# Altium project 6502.PrjPcb
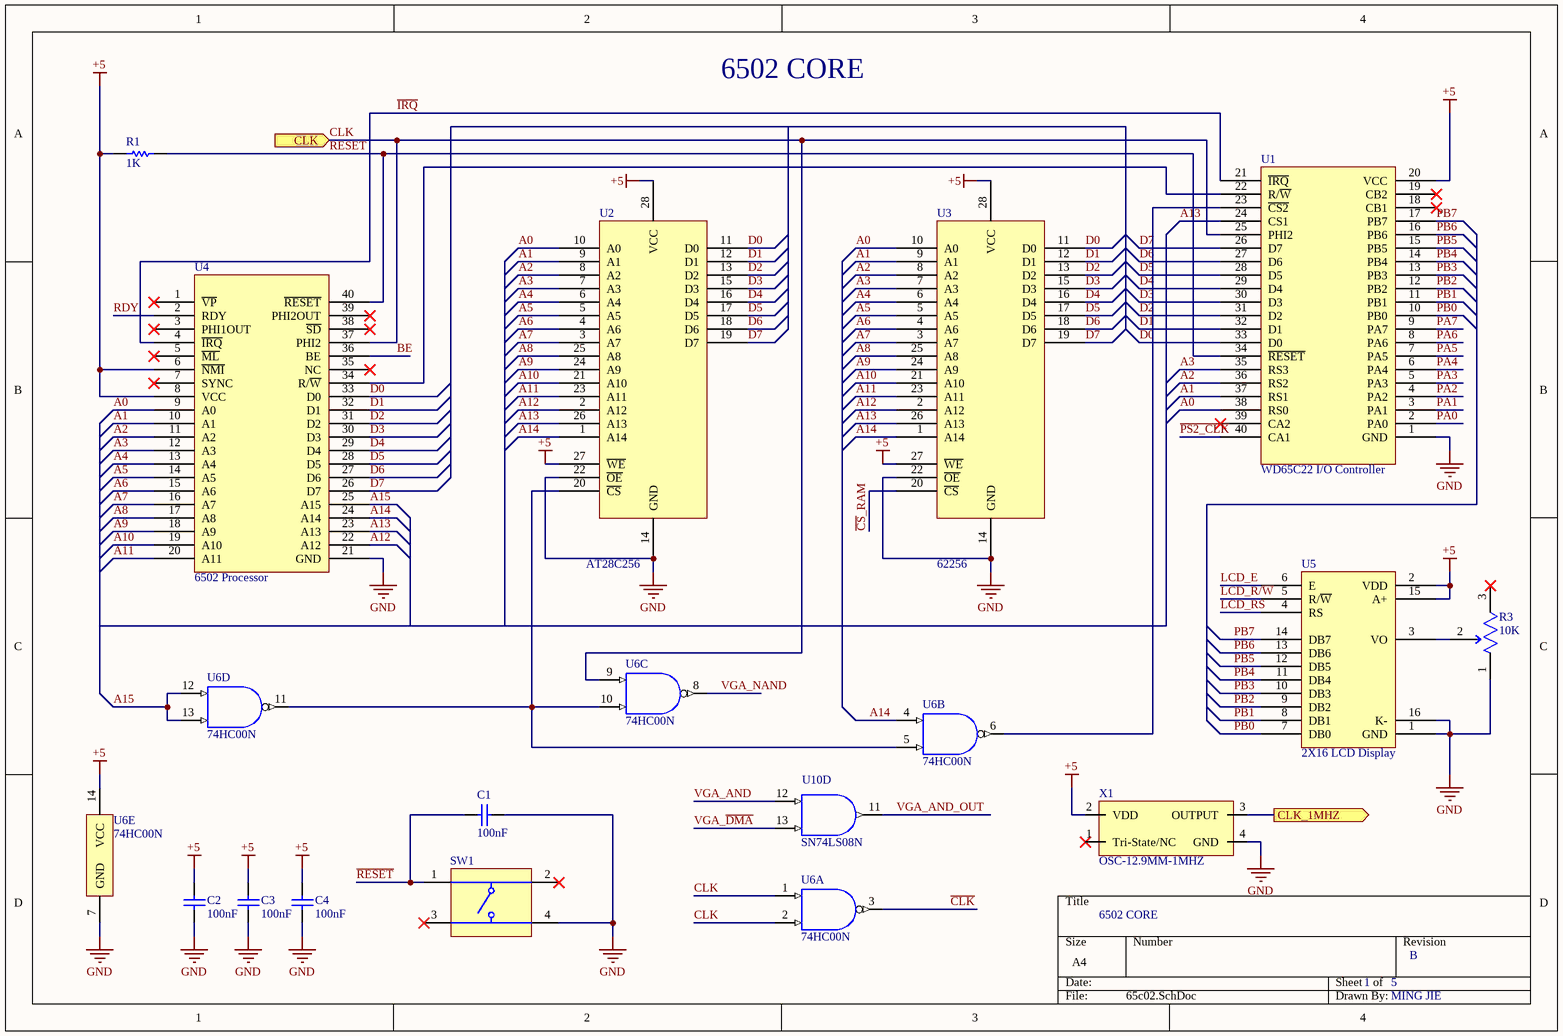
[diagram p0: 65c02.SchDoc]
5 sheets, 111 parts. Net scope: global (net labels, ports and power ports of the same name join across sheets).
Board file: 6502_carrier.PcbDoc
Sheets:
  65c02.SchDoc
  clock_module.SchDoc
  address_LEDs.SchDoc
  config_headers.SchDoc
  ps2_interface.SchDoc

## Sheet 65c02.SchDoc: 6502 Core
size A4; Engineer: Ming Jie See; Revision: 1; SheetNumber: 1; SheetTotal: 5

### Parts
C1  Capacitance: 100nF  [CAPC2013X135X45ML10T25]  (hidden comment: GRM21BR71H104KA01L)
C2  Capacitance: 100nF  [CAPC2013X135X45ML10T25]  (hidden comment: GRM21BR71H104KA01L)
C3  Capacitance: 100nF  [CAPC2013X135X45ML10T25]  (hidden comment: GRM21BR71H104KA01L)
C4  Capacitance: 100nF  [CAPC2013X135X45ML10T25]  (hidden comment: GRM21BR71H104KA01L)
R1  Resistance: 1K  [RESC2013X50X30NL20T20]  (hidden comment: CRCW08051K00FKEA)
R3  Resistance: 10K  [FP-3296W-MFG]  (hidden comment: 3296W-1-103RLF)
SW1  K2-1102SP-C4SC-04  [TECO-FSM4JSMA_V]  (value not drawn)
U1  WD65C22 I/O Controller  [PDIP_40]
U2  AT28C256  [DIP_28]
U3  62256  [DIP_28]
U4  6502 Processor  [PDIP_40]
U5  2X16 LCD Display  [LCD_2x16]
U6  74HC00N  [NXP-SOT27-1-14]  (parts A,B,C,D,E of 5)
U10  SN74LS08N  [N0014A]  (part D of 5)
X1  OSC-12.9MM-1MHZ  [OSC_THT_12-9MM]

### Ports
CLK (in), CLK_1MHZ (out)

### Nets
+5: C2.1 C3.1 C4.1 R1.1 U1.20(VCC) U2.27(~{WE}) U2.28(VCC) U3.27(~{WE}) U3.28(VCC) U4.6(~{NMI}) U4.8(VCC) U5.2(VDD) U5.15(A+) U6.14(VCC) X1.2(VDD)
GND: C1.1 C2.2 C3.2 C4.2 R3.1(CCW) SW1.4 U1.1(GND) U2.14(GND) U2.22(~{OE}) U3.14(GND) U3.22(~{OE}) U4.21(GND) U5.1(GND) U5.16(K-) U6.7(GND) X1.4(GND)
A0: U1.38(RS0) U2.10(A0) U3.10(A0) U4.9(A0)
A1: U1.37(RS1) U2.9(A1) U3.9(A1) U4.10(A1)
A2: U1.36(RS2) U2.8(A2) U3.8(A2) U4.11(A2)
A3: U1.35(RS3) U2.7(A3) U3.7(A3) U4.12(A3)
A4: U2.6(A4) U3.6(A4) U4.13(A4)
A5: U2.5(A5) U3.5(A5) U4.14(A5)
A6: U2.4(A6) U3.4(A6) U4.15(A6)
A7: U2.3(A7) U3.3(A7) U4.16(A7)
A8: U2.25(A8) U3.25(A8) U4.17(A8)
A9: U2.24(A9) U3.24(A9) U4.18(A9)
A10: U2.21(A10) U3.21(A10) U4.19(A10)
A11: U2.23(A11) U3.23(A11) U4.20(A11)
A12: U2.2(A12) U3.2(A12) U4.22(A12)
A13: U1.24(CS1) U2.26(A13) U3.26(A13) U4.23(A13)
A14: U2.1(A14) U3.1(A14) U4.24(A14) U6.4(2A)
A15: U4.25(A15) U6.12(4A) U6.13(4B)
BE: U4.36(BE)
~{CLK}: U6.3(~{1Y})
~{CS}_RAM: U3.20(~{CS})
CLK: U1.25(PHI2) U4.37(PHI2) U6.1(1A) U6.2(1B) U6.9(3A) ; port CLK
D0: U1.33(D0) U2.11(D0) U3.11(D0) U4.33(D0)
D1: U1.32(D1) U2.12(D1) U3.12(D1) U4.32(D1)
D2: U1.31(D2) U2.13(D2) U3.13(D2) U4.31(D2)
D3: U1.30(D3) U2.15(D3) U3.15(D3) U4.30(D3)
D4: U1.29(D4) U2.16(D4) U3.16(D4) U4.29(D4)
D5: U1.28(D5) U2.17(D5) U3.17(D5) U4.28(D5)
D6: U1.27(D6) U2.18(D6) U3.18(D6) U4.27(D6)
D7: U1.26(D7) U2.19(D7) U3.19(D7) U4.26(D7)
~{IRQ}: U1.21(~{IRQ}) U4.4(~{IRQ})
LCD_E: U5.6(E)
LCD_R/~{W}: U5.5(R/~{W})
LCD_RS: U5.4(RS)
~{PS2_CLK}: U1.40(CA1)
PA0: U1.2(PA0)
PA1: U1.3(PA1)
PA2: U1.4(PA2)
PA3: U1.5(PA3)
PA4: U1.6(PA4)
PA5: U1.7(PA5)
PA6: U1.8(PA6)
PA7: U1.9(PA7)
PB0: U1.10(PB0) U5.7(DB0)
PB1: U1.11(PB1) U5.8(DB1)
PB2: U1.12(PB2) U5.9(DB2)
PB3: U1.13(PB3) U5.10(DB3)
PB4: U1.14(PB4) U5.11(DB4)
PB5: U1.15(PB5) U5.12(DB5)
PB6: U1.16(PB6) U5.13(DB6)
PB7: U1.17(PB7) U5.14(DB7)
~{RESET}: C1.2 R1.2 SW1.1 U1.34(~{RESET}) U4.40(~{RESET})
RDY: U4.2(RDY)
VGA_AND: U10.12(4A)
VGA_AND_OUT: U10.11(4Y)
VGA_~{DMA}: U10.13(4B)
VGA_NAND: U6.8(~{3Y})
NetP5_3: X1.3(OUTPUT) ; port CLK_1MHZ
NetR3_2: R3.2(WIPER) U5.3(VO)
NetU1_22: U1.22(R/~{W}) U4.34(R/~{W})
NetU1_23: U1.23(~{CS2}) U6.6(~{2Y})
NetU2_20: U2.20(~{CS}) U6.5(2B) U6.10(3B) U6.11(~{4Y})

Not connected (* = marked no-connect by the designer): R3 3(CW)*; SW1 2* 3*; U1 18(CB1)* 19(CB2)* 39(CA2)*; U4 1(~{VP})* 3(PHI1OUT)* 5(~{ML})* 7(SYNC)* 35(NC)* 38(~{SD})* 39(PHI2OUT)*; X1 1(Tri-State/NC)*

### Notes on the sheet
- 6502 CORE
- 1
- 5
- B
- MING JIE

### Library data of the parts
C1-C4 = CMP-2100-03644-1: Chip Capacitor, 0.1 uF, +/- 10%, 50 V, -55 to 125 degC, 0805 (2012 Metric), RoHS, Tape and Reel; Manufacturer: Murata; Voltage: 50V; Insulation Resistance: 10GR; Dielectric Material: Ceramic; Dielectric: X7R; Package Description: 2-Pin Surface Mount Device, Body 2 x 1.25 mm; Manufacturer URL: http://www.murata.com/; Case Code (Imperial): 0805; Datasheet URL: http://psearch.en.murata.com/capacitor/product/GRM21BR71H104KA01%23.pdf; Termination: SMD/SMT; Lead Free: LeadFree; Package Quantity: 1; Mount: SurfaceMount; REACH SVHC: Unknown; Thickness: 0.053inch; Height: 1.25mm; Case/Package: 0805; Voltage Rating: 50V; Width: 0.049inch; Case Code (Metric): 2012; Material: Ceramic; Min Operating Temperature: -55degC; RoHSCompliant: true; Datasheet Version: 42675.0; Voltage Rating (DC): 50V; Tolerance: 10%; Package Reference: 0805; Depth: 1.25mm; Length: 2mm; Max Operating Temperature: 125degC; Packaging: TapeandReel; Number of Pins: 2; Radiation Hardening: No
R1 = CMP-1013-00510-2: Manufacturer: Vishay Dale; Part Number: CRCW08051K00FKEA
R3 = CMP-07234-000024-1: TRIMMER 10K OHM 0.5W PC PIN TOP; Temperature Coefficient: 100ppm/°C; Power Rating: 500mW; Tolerance: 10%; Number of Turns: 25; Width: 0.19inch; Termination: Pin; Radiation Hardening: No; Contact Plating: Tin; Composition: Cermet; Length: 9.53mm; Height: 0.395inch; Depth: 4.83mm; REACH SVHC: No SVHC; Weight: 0.03oz; Min Operating Temperature: -55°C; Military Standard: Not; Max Operating Temperature: 125°C; Packaging: Tape and Reel; Package Quantity: 1; Taper: Linear; Max Power Dissipation: 500mW; Mount: Through Hole
SW1 = CMP-2000-05602-2: Swicth, SPST, 24 V, -35 to 85 degC, 4-Pin SMD, RoHS, Tape and Reel; Manufacturer: TE Connectivity; Switch Travel: 0.25mm; Mechanical Life: 100000Cycles; Contact Current Rating: 50mA; Operating Force: 1.57N; Actuator Material: Polyamide; Contact Resistance: 100mOhm; Voltage Rating: 24V; Illumination Type: Illuminated; Actuator Length: 0.055inch; Max Voltage Rating (DC): 12V; Case\/Package: SMD/SMT; Orientation: Straight; Datasheet URL: http://www.te.com/commerce/DocumentDelivery/DDEController?Action=showdoc&DocId=Customer+Drawing%7F2-1437565-7%7FV%7Fpdf%7FEnglish%7FENG_CD_2-1437565-7_V.pdf%7F4-1437565-2; Min Operating Temperature: -35degC; Packaging: LoosePiece; Termination: GullWing; Throw Configuration: SPST; Package Description: 4-Pin Surface Mount Device, Body 6 x 6 mm, Pitch 4.5 mm; Mounting Technology: SurfaceMount; Contact Plating: Silver; Datasheet Version: Rev. V, 02/2015; RoHSCompliant: true; Max Operating Temperature: 85degC; Length: 6mm; Voltage Rating (DC): 24V; Electrical Life: 100000Cycles; Current Rating: 50mA; Package Quantity: 750; Mount: SurfaceMount; Package Reference: FSM4JSMA; Manufacturer URL: http://www.te.com/; Width: 6mm; REACH SVHC: Unknown; Contact Material: CopperAlloy
U1 = WD65C22: WD65C22 PDIP-40, I/O Controller
U2 = AT28C256: Paged Parallel EEPROM AT28C256
U3 = 62256: 32K x 8, SRAM
U4 = WDC65C02: WDC 6502 PDIP-40
U5 = LCM1602C: 2X16 LCD Display, Parallel input
U6 = CMP-0976-00001-1: Quad 2-input NAND gate, CMOS, 2 to 6 V, -40 to 125 degC, 14-Pin DIP (SOT27-1), RoHS, Bulk; Manufacturer: NXP Semiconductors; VCC (V): 2 to 6; Nr of bits: 4; tpd (ns): 7; Output drive capability (mA): +/- 5.2; fmax (MHz): 36; PackageReference: SOT27-1; ComponentLink1URL: http://www.nxp.com/; ComponentLink3Description: Package Specification; ComponentLink1Description: Manufacturer URL; DatasheetVersion: Rev. 6; Temperature Range: -40 to 125 degC; ComponentLink2Description: Datasheet; RoHS: TRUE; ComponentLink2URL: http://www.nxp.com/documents/data_sheet/74HC_HCT00.pdf; PackageVersion: Feb-03; PartNumber: 74HC00N; Input levels: CMOS; PackageDescription: 14-Pin plastic dual in-line package, Body 19.025 x 6.34 mm, Pitch 2.54 mm; Mounting Technology: Through Hole; ComponentLink3URL: http://www.nxp.com/documents/outline_drawing/sot027-1_po.pdf; Packing: Bulk
U10 = CMP-0777-00259-3: Quadruple 2-Input Positive-AND Gates, N0014A, TUBE; Manufacturer: Texas Instruments; VCC(Max)(V): 5.25; ICC @ Nom Voltage(Max)(mA): 0.021; VCC(Min)(V): 4.75; tpd @ Nom Voltage(Max)(ns): 25; Rating: Catalog; Output Type: TTL; Bits(#): 4; Schmitt Trigger: No; Voltage(Nom)(V): 5; Technology Family: LS; F @ Nom Voltage(Max)(Mhz): 35; Output Drive (IOL/IOH)(Max)(mA): -0.8/16; PackageReference: N0014A; DatasheetVersion: SDLS033; Input Type: TTL; Operating Temperature Range(C): 0 to 70; Generic Part Number: SN74LS08
X1 = OSC-12.9MM-1MHZ: 12.9MM x 12.9MM, 1MHz Can Oscillator

## Sheet clock_module.SchDoc
size A4; SheetNumber: 2; SheetTotal: 5
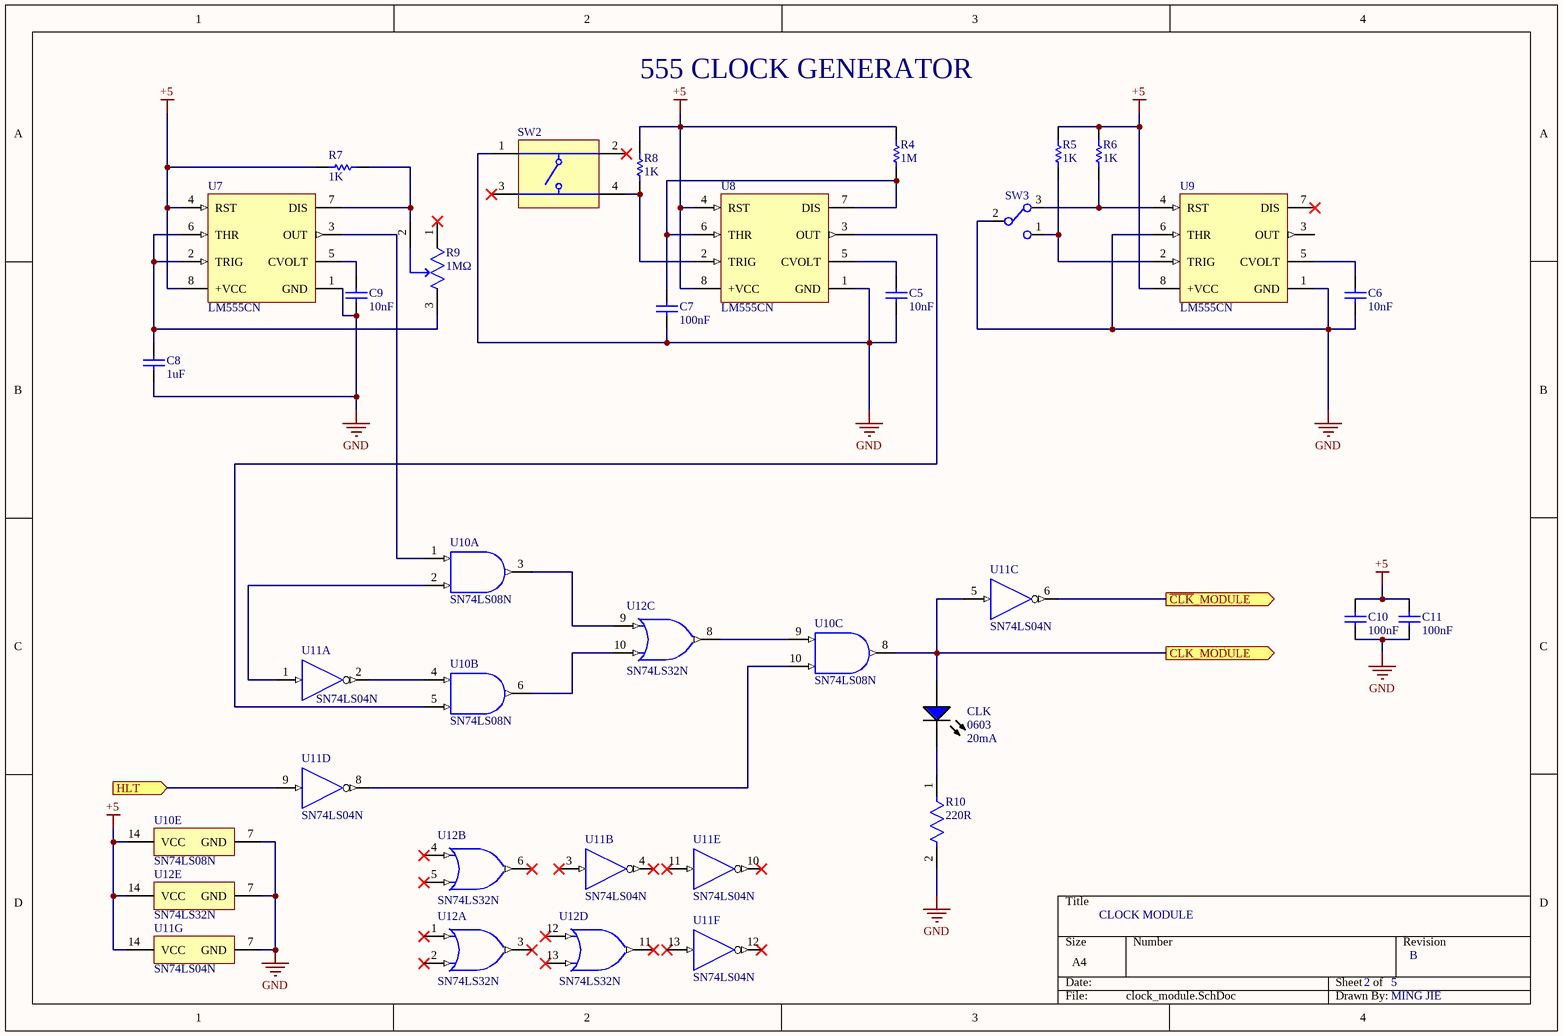
[diagram p1: clock_module.SchDoc]

### Parts
C5  Capacitance: 10nF  [CAPC2013X70X45ML10T25]  (hidden comment: GRM216R71H103KA01D)
C6  Capacitance: 10nF  [CAPC2013X70X45ML10T25]  (hidden comment: GRM216R71H103KA01D)
C7  Capacitance: 100nF  [CAPC2013X135X45ML10T25]  (hidden comment: GRM21BR71H104KA01L)
C8  Capacitance: 1uF  [CAPC2013X70X45NL10T25]  (hidden comment: GRM216R61E105KA12D)
C9  Capacitance: 10nF  [CAPC2013X70X45ML10T25]  (hidden comment: GRM216R71H103KA01D)
C10  Capacitance: 100nF  [CAPC2013X135X45ML10T25]  (hidden comment: GRM21BR71H104KA01L)
C11  Capacitance: 100nF  [CAPC2013X135X45ML10T25]  (hidden comment: GRM21BR71H104KA01L)
CLK  Package Reference: 0603  Test Current: 20mA  [EVRL-0603-2_V]  (hidden comment: 19-217/BHC-ZL1M2RY/3T)
R4  Resistance: 1M  [RESC2013X50X30NL20T20]  (hidden comment: CRCW08051M00JNEA)
R5  Resistance: 1K  [RESC2013X50X30NL20T20]  (hidden comment: CRCW08051K00FKEA)
R6  Resistance: 1K  [RESC2013X50X30NL20T20]  (hidden comment: CRCW08051K00FKEA)
R7  Resistance: 1K  [RESC2013X50X30NL20T20]  (hidden comment: CRCW08051K00FKEA)
R8  Resistance: 1K  [RESC2013X50X30NL20T20]  (hidden comment: CRCW08051K00FKEA)
R9  Resistance: 1MΩ  [FP-3296W-MFG]  (hidden comment: 3296W-1-105LF)
R10  Resistance: 220R  [FP-CRCW0805-e3-MFG]  (hidden comment: CRCW0805220RFKEA)
SW2  K2-1102SP-C4SC-04  [TECO-FSM4JSMA_V]  (value not drawn)
SW3  SS-12D02-VG4  [5_2-54mm_SPDT]  (value not drawn)
U7  LM555CN  [N08E]
U8  LM555CN  [N08E]
U9  LM555CN  [N08E]
U10  SN74LS08N  [N0014A]  (parts A,B,C,E of 5)
U11  SN74LS04N  [N0014A]  (parts A,B,C,D,E,F,G of 7)
U12  SN74LS32N  [N0014A]  (parts A,B,C,D,E of 5)

### Ports
CLK_MODULE (out), HLT (in), ~{CLK}_MODULE (out)

### Nets
+5: C10.1 C11.1 R4.1 R5.2 R6.2 R7.1 R8.2 U7.4(RST) U7.8(+VCC) U8.4(RST) U8.8(+VCC) U9.8(+VCC) U10.14(VCC) U11.14(VCC) U12.14(VCC)
GND: C5.1 C6.1 C7.2 C8.2 C9.1 C10.2 C11.2 R10.2 SW2.1 SW3.2 U7.1(GND) U8.1(GND) U9.1(GND) U9.6(THR) U10.7(GND) U11.7(GND) U12.7(GND)
NetC5_2: C5.2 U8.5(CVOLT)
NetC6_2: C6.2 U9.5(CVOLT)
NetC7_1: C7.1 R4.2 U8.6(THR) U8.7(DIS)
NetC8_1: C8.1 R9.3(CW) U7.2(TRIG) U7.6(THR)
NetC9_2: C9.2 U7.5(CVOLT)
NetCLK_1: CLK.1(A) U10.8(3Y) U11.5(3A) ; port CLK_MODULE
NetCLK_2: CLK.2(K) R10.1
NetR5_1: R5.1 SW3.1 U9.2(TRIG)
NetR6_1: R6.1 SW3.3 U9.4(RST)
NetR7_2: R7.2 R9.2(WIPER) U7.7(DIS)
NetR8_1: R8.1 SW2.4 U8.2(TRIG)
NetU7_3: U7.3(OUT) U10.1(1A)
NetU8_3: U8.3(OUT) U10.5(2B)
NetU10_2: U10.2(1B) U11.1(1A)
NetU10_3: U10.3(1Y) U12.9(3A)
NetU10_4: U10.4(2A) U11.2(~{1Y})
NetU10_6: U10.6(2Y) U12.10(3B)
NetU10_9: U10.9(3A) U12.8(3Y)
NetU10_10: U10.10(3B) U11.8(~{4Y})
NetU11_6: U11.6(~{3Y}) ; port ~{CLK}_MODULE
NetU11_9: U11.9(4A) ; port HLT

Not connected (* = marked no-connect by the designer): R9 1(CCW)*; SW2 2* 3*; U9 3(OUT) 7(DIS)*; U11 3(2A)* 4(~{2Y})* 10(~{5Y})* 11(5A)* 12(~{6Y})* 13(6A)*; U12 1(1A)* 2(1B)* 3(1Y)* 4(2A)* 5(2B)* 6(2Y)* 11(4Y)* 12(4A)* 13(4B)*

### Notes on the sheet
- 555 CLOCK GENERATOR
- CLOCK MODULE
- 2
- 5
- B
- MING JIE

### Library data of the parts
C5 C6 C9 = CMP-2000-05013-1: Chip Capacitor, 10 nF, +/- 10%, 50 V, -55 to 125 degC, 0805 (2012 Metric), RoHS, Tape and Reel; Manufacturer: Murata; Voltage Rating DC: 50V; Temperature Coefficient / Code: +/-15%; Capacitance - pF: 10000pF; Case Height: 0.6mm; Dielectric: X7R; Case Length: 2mm; Case Width: 1.25mm; Type: GeneralPurposeMLCC; Brand: MurataElectronics; Tolerance: 10%; Product Category: MultilayerCeramicCapacitorsMLCC-SMD/SMT; Minimum Operating Temperature: -55C; Voltage Rating: 50V; Series: GRM; Packaging: Reel; Dimensions: 1.25mmWx2mmLx0.6mmH; Operating Temperature Range: -55Cto+125C; Package / Case: 0805(2012metric); Datasheet URL: https://datasheet.ciiva.com/29201/452521-da-01-en-vs-kondensator-0805-29201121.pdf; Maximum Operating Temperature: +125C; Factory Pack Quantity: 4000; Case Code - in: 0805; Case Code - mm: 2012; Manufacturer URL: http://www.murata.com/; Termination Style: SMD/SMT; Datasheet Version: Dec-10; RoHS: Details; Product: GeneralTypeMLCCs; Capacitance - nF: 10nF
C7 C10 C11 = CMP-2100-03644-1: as C1 on sheet 65c02; Package Description: 2-Pin Surface Mount Device, Body 2 x 1.25 mm; Manufacturer URL: http://www.murata.com/; Case Code (Imperial): 0805; Datasheet URL: http://psearch.en.murata.com/capacitor/product/GRM21BR71H104KA01%23.pdf; Termination: SMD/SMT; Lead Free: LeadFree; Package Quantity: 1; Mount: SurfaceMount; REACH SVHC: Unknown; Thickness: 0.053inch; Height: 1.25mm; Case/Package: 0805; Voltage Rating: 50V; Width: 0.049inch; Case Code (Metric): 2012; Material: Ceramic; Min Operating Temperature: -55degC; RoHSCompliant: true; Datasheet Version: 42675.0; Voltage Rating (DC): 50V; Tolerance: 10%; Package Reference: 0805; Depth: 1.25mm; Length: 2mm; Max Operating Temperature: 125degC; Packaging: TapeandReel; Number of Pins: 2; Radiation Hardening: No
C8 = CMP-2007-00957-1: Manufacturer: Murata; Part Number: GRM216R61E105KA12D
CLK = CMP-2100-03577-1: Chip LED, Blue, 5 V, 25 mA, -40 to 85 degC, 2-Pin SMD (0603), RoHS, Tape and Reel; Manufacturer: Everlight Electronics; Number of LEDs: 1; Luminous Intensity: 28.5mcd; Lens Style: Rectangular; Forward Current: 25mA; Power Dissipation: 110W; Forward Voltage: 3V; Viewing Angle: 120degrees; Dominant Wavelength: 470nm; Max Operating Temperature: 85degC; Mount: SurfaceMount; Package Description: 2-Pin Surface Mount Device, Body 1.6 x 0.8 mm; Depth: 0.8mm; Packaging: TapeandReel; Length: 1.6mm; Radiation Hardening: No; Colour: Blue; Datasheet Version: Rev. 1.0, 03/2003; Min Operating Temperature: -40degC; Number of Elements: 1; Manufacturer URL: http://www.everlight.com/; Datasheet URL: https://datasheet.ciiva.com/26901/getdatasheetpartid-420616-26901324.pdf; Case/Package: SMD/SMT; Lead Free: LeadFree; RoHSCompliant: true; Number of Pins: 2
R4 = CMP-2001-03632-1: Manufacturer: Vishay Dale; Part Number: CRCW08051M00JNEA
R5-R8 = CMP-1013-00510-2: Manufacturer: Vishay Dale; Part Number: CRCW08051K00FKEA
R9 = CMP-2000-05583-2: TRIMMER 1M OHM 0.5W PC PIN TOP; Manufacturer: Bourns; Manufacturer Part Number: 3296W-1-504LF; Temperature Coefficient: 100ppm/°C; Value: 1MΩ; Tolerance: 10%; Voltage Rating: 300V; Standoff Height: 0.38mm; ComponentLink2Description: Datasheet; Package: 3296W; Series: Trimpot 3296-Sealed; Lead Free: Yes; Octopart: https://octopart.com/3296w-1-504lf-bourns-143884; Device Class L2: Resistors; Automotive: No; RoHS: TRUE; Temperature Range High: +125°C; Height: 12.05mm; Power Rating: 0.5W; Temperature Range Low: -55°C; ComponentLink2URL: https://www.bourns.com/docs/Product-Datasheets/3296.pdf; Device Class L1: Passive Components; Device Class L3: Variable Resistors and Potentiometers; Category: Res; Temperature: -55°C to +125°C; Digikey Description: TRIMMER 500K OHM 0.5W PC PIN TOP; Mouser Description: Trimmer; Cermet; Rest 500 Kilohms; PCB; 25 Turns; Pwr-Rtg 0.5W
R10 = CMP-2001-03682-2: RES Thick Film, 220Ω, 1%, 0.125W, 100ppm/°C, 0805; Max Power Dissipation: 125mW; Voltage Rating: 150V; Packaging: Tape and Reel; Termination: SMD/SMT; Height: 0.45mm; Package Quantity: 10; Width: 0.049inch; Min Operating Temperature: -55°C; Lead Free: Lead Free; Military Standard: Not; Mount: Surface Mount; Max Operating Temperature: 155°C; Voltage Rating (DC): 150V; Composition: Thick Film; Case/Package: 0805; Length: 2mm; Weight: 0.000194oz; Case Code (Metric): 2012; Number of Terminations: 2; Case Code (Imperial): 0805; Radiation Hardening: No; Tolerance: 1%; Features: Automotive AEC-Q200; Power Rating: 125mW; Depth: 1.25mm; Contact Plating: Tin; Temperature Coefficient: 100ppm/°C
SW2 = CMP-2000-05602-2: as SW1 on sheet 65c02; Orientation: Straight; Datasheet URL: http://www.te.com/commerce/DocumentDelivery/DDEController?Action=showdoc&DocId=Customer+Drawing%7F2-1437565-7%7FV%7Fpdf%7FEnglish%7FENG_CD_2-1437565-7_V.pdf%7F4-1437565-2; Min Operating Temperature: -35degC; Packaging: LoosePiece; Termination: GullWing; Throw Configuration: SPST; Package Description: 4-Pin Surface Mount Device, Body 6 x 6 mm, Pitch 4.5 mm; Mounting Technology: SurfaceMount; Contact Plating: Silver; Datasheet Version: Rev. V, 02/2015; RoHSCompliant: true; Max Operating Temperature: 85degC; Length: 6mm; Voltage Rating (DC): 24V; Electrical Life: 100000Cycles; Current Rating: 50mA; Package Quantity: 750; Mount: SurfaceMount; Package Reference: FSM4JSMA; Manufacturer URL: http://www.te.com/; Width: 6mm; REACH SVHC: Unknown; Contact Material: CopperAlloy
SW3 = SS-12D02-VG4: SPDT, Korean Hroparts Elec SS-12D02-VG4
U7-U9 = CMP-0056-00017-2: Timer, 8-pin MDIP; Manufacturer: National Semiconductor; CompType: Analog IC; PackageTopMarking: NSUZXYTTE#*LM*555CN; PowerWise: N; PackageReference: N08E; ComponentLink1Description: LM555 Datasheet; ComponentLink3URL: http://www.national.com/packaging/folders/n08e.html; ComponentLink1URL: http://www.national.com/ds/LM/LM555.pdf; ComponentLink2URL: http://www.national.com/pf/LM/LM555.html; PackageDescription: MDIP, .365 x .250 x .130in, 8 Lead, .100in Pitch; DatasheetVersion: Jul-2006; RevisionNote: Component URLs added; Code_JEDEC: MS-001-BA; PinCount: 8; ComponentLink3Description: N08E Package Page; PackageVersion: revG, May-2006; ComponentLink2Description: LM555 Web Page; RoHS: N
U10 = CMP-0777-00259-3: as U10 on sheet 65c02; PackageReference: N0014A; DatasheetVersion: SDLS033; Input Type: TTL; Operating Temperature Range(C): 0 to 70; Generic Part Number: SN74LS08
U11 = CMP-1615-00911-2: Hex inverters, N0014A, TUBE; Manufacturer: Texas Instruments; Output Drive (IOL/IOH)(Max)(mA): -0.4/8; Schmitt Trigger: No; F @ Nom Voltage(Max)(Mhz): 35; Voltage(Nom)(V): 5; Technology Family: LS; Input Type: TTL; Output Type: CMOS; Bits(#): 6; VCC(Max)(V): 5.25; ICC @ Nom Voltage(Max)(mA): 0.033; Rating: Catalog; VCC(Min)(V): 4.75; tpd @ Nom Voltage(Max)(ns): 22; Operating Temperature Range(C): 0 to 70; DatasheetVersion: SDLS029C; Generic Part Number: SN74LS04; Code_JEDEC: MS-001; PackageReference: N0014A
U12 = CMP-1573-00145-3: Quad 2-input positive-OR gates, N0014A, TUBE; Manufacturer: Texas Instruments; tpd @ Nom Voltage(Max)(ns): 22; Output Drive (IOL/IOH)(Max)(mA): 0.8/-16; Input Type: TTL; VCC(Min)(V): 4.75; F @ Nom Voltage(Max)(Mhz): 35; Voltage(Nom)(V): 5; ICC @ Nom Voltage(Max)(mA): 0.038; VCC(Max)(V): 5.25; Rating: Catalog; Bits(#): 4; Generic Part Number: SN74LS32; DatasheetVersion: SDLS100; Operating Temperature Range(C): 0 to 70; Output Type: TTL; Code_JEDEC: MS-001; PackageVersion: http://www.ti.com/lit/ml/mpdi002c/mpdi002c.pdf; PackageReference: N0014A

## Sheet address_LEDs.SchDoc
size A4; SheetNumber: 3; SheetTotal: 5
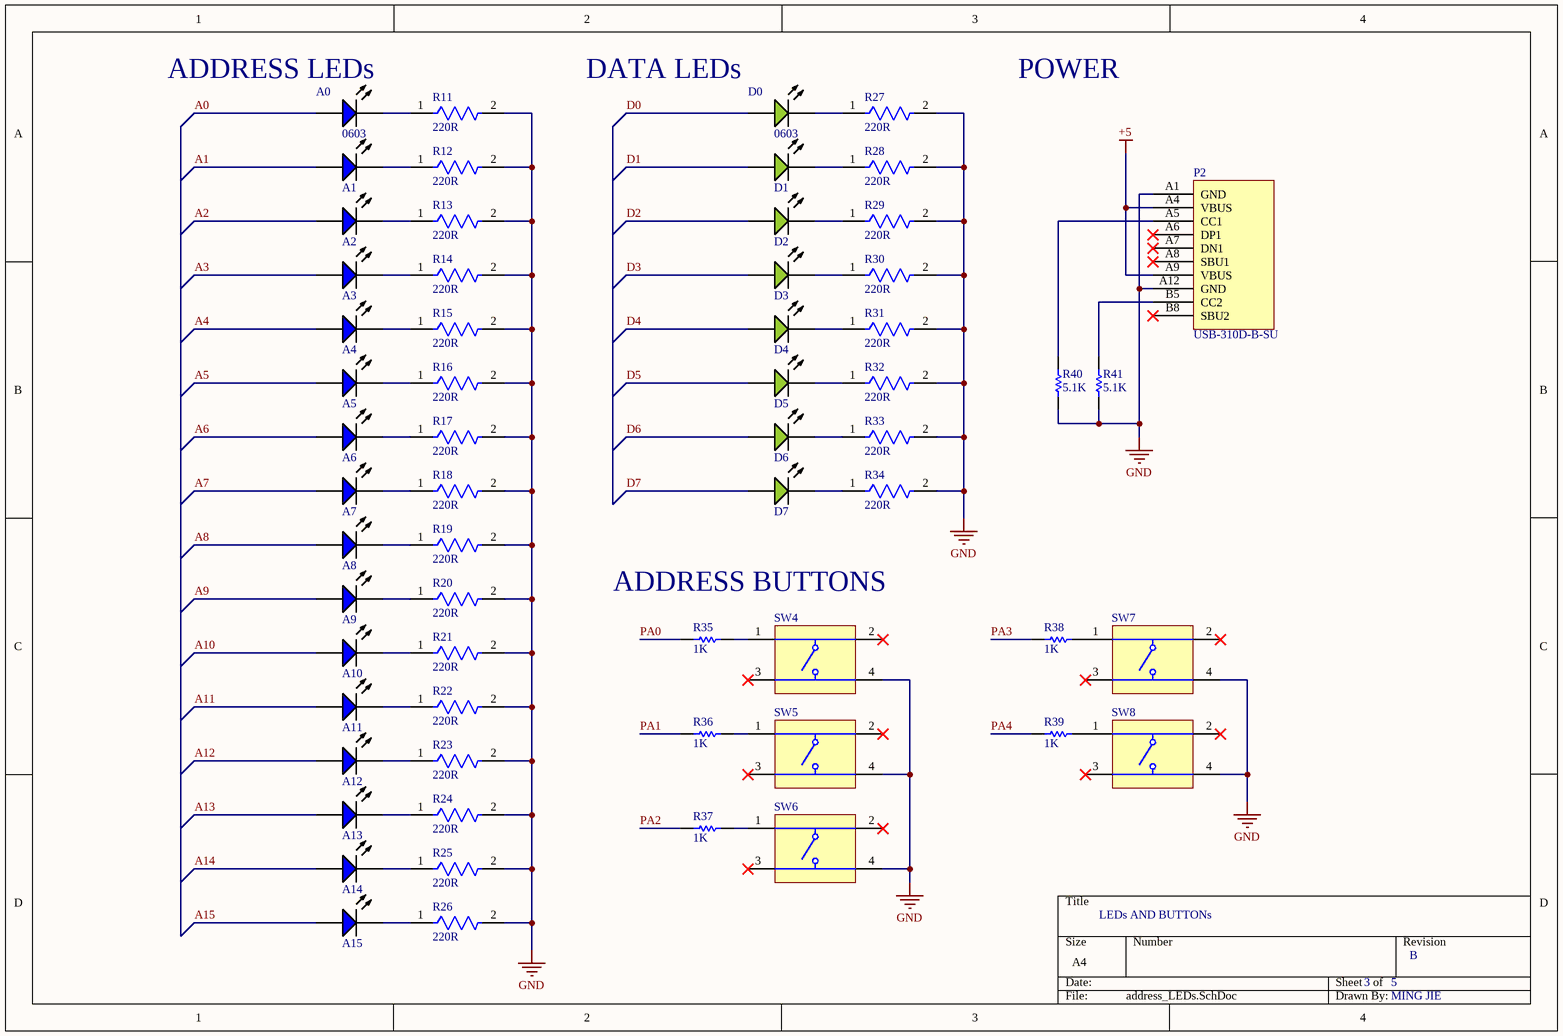
[diagram p2: address_LEDs.SchDoc]

### Parts
A0  Package Reference: 0603  [EVRL-0603-2_V]  (hidden comment: 19-217/BHC-ZL1M2RY/3T)
A1  19-217/BHC-ZL1M2RY/3T  [EVRL-0603-2_V]  (value not drawn)
A2  19-217/BHC-ZL1M2RY/3T  [EVRL-0603-2_V]  (value not drawn)
A3  19-217/BHC-ZL1M2RY/3T  [EVRL-0603-2_V]  (value not drawn)
A4  19-217/BHC-ZL1M2RY/3T  [EVRL-0603-2_V]  (value not drawn)
A5  19-217/BHC-ZL1M2RY/3T  [EVRL-0603-2_V]  (value not drawn)
A6  19-217/BHC-ZL1M2RY/3T  [EVRL-0603-2_V]  (value not drawn)
A7  19-217/BHC-ZL1M2RY/3T  [EVRL-0603-2_V]  (value not drawn)
A8  19-217/BHC-ZL1M2RY/3T  [EVRL-0603-2_V]  (value not drawn)
A9  19-217/BHC-ZL1M2RY/3T  [EVRL-0603-2_V]  (value not drawn)
A10  19-217/BHC-ZL1M2RY/3T  [EVRL-0603-2_V]  (value not drawn)
A11  19-217/BHC-ZL1M2RY/3T  [EVRL-0603-2_V]  (value not drawn)
A12  19-217/BHC-ZL1M2RY/3T  [EVRL-0603-2_V]  (value not drawn)
A13  19-217/BHC-ZL1M2RY/3T  [EVRL-0603-2_V]  (value not drawn)
A14  19-217/BHC-ZL1M2RY/3T  [EVRL-0603-2_V]  (value not drawn)
A15  19-217/BHC-ZL1M2RY/3T  [EVRL-0603-2_V]  (value not drawn)
D0  Package Reference: 0603  [EVRL-0603-2_V]  (hidden comment: 19-217/GHC-YR1S2/3T)
D1  19-217/GHC-YR1S2/3T  [EVRL-0603-2_V]  (value not drawn)
D2  19-217/GHC-YR1S2/3T  [EVRL-0603-2_V]  (value not drawn)
D3  19-217/GHC-YR1S2/3T  [EVRL-0603-2_V]  (value not drawn)
D4  19-217/GHC-YR1S2/3T  [EVRL-0603-2_V]  (value not drawn)
D5  19-217/GHC-YR1S2/3T  [EVRL-0603-2_V]  (value not drawn)
D6  19-217/GHC-YR1S2/3T  [EVRL-0603-2_V]  (value not drawn)
D7  19-217/GHC-YR1S2/3T  [EVRL-0603-2_V]  (value not drawn)
P2  USB-310D-B-SU  [USB-C-THT]
R11  Resistance: 220R  [FP-CRCW0805-e3-MFG]  (hidden comment: CRCW0805220RFKEA)
R12  Resistance: 220R  [FP-CRCW0805-e3-MFG]  (hidden comment: CRCW0805220RFKEA)
R13  Resistance: 220R  [FP-CRCW0805-e3-MFG]  (hidden comment: CRCW0805220RFKEA)
R14  Resistance: 220R  [FP-CRCW0805-e3-MFG]  (hidden comment: CRCW0805220RFKEA)
R15  Resistance: 220R  [FP-CRCW0805-e3-MFG]  (hidden comment: CRCW0805220RFKEA)
R16  Resistance: 220R  [FP-CRCW0805-e3-MFG]  (hidden comment: CRCW0805220RFKEA)
R17  Resistance: 220R  [FP-CRCW0805-e3-MFG]  (hidden comment: CRCW0805220RFKEA)
R18  Resistance: 220R  [FP-CRCW0805-e3-MFG]  (hidden comment: CRCW0805220RFKEA)
R19  Resistance: 220R  [FP-CRCW0805-e3-MFG]  (hidden comment: CRCW0805220RFKEA)
R20  Resistance: 220R  [FP-CRCW0805-e3-MFG]  (hidden comment: CRCW0805220RFKEA)
R21  Resistance: 220R  [FP-CRCW0805-e3-MFG]  (hidden comment: CRCW0805220RFKEA)
R22  Resistance: 220R  [FP-CRCW0805-e3-MFG]  (hidden comment: CRCW0805220RFKEA)
R23  Resistance: 220R  [FP-CRCW0805-e3-MFG]  (hidden comment: CRCW0805220RFKEA)
R24  Resistance: 220R  [FP-CRCW0805-e3-MFG]  (hidden comment: CRCW0805220RFKEA)
R25  Resistance: 220R  [FP-CRCW0805-e3-MFG]  (hidden comment: CRCW0805220RFKEA)
R26  Resistance: 220R  [FP-CRCW0805-e3-MFG]  (hidden comment: CRCW0805220RFKEA)
R27  Resistance: 220R  [FP-CRCW0805-e3-MFG]  (hidden comment: CRCW0805220RFKEA)
R28  Resistance: 220R  [FP-CRCW0805-e3-MFG]  (hidden comment: CRCW0805220RFKEA)
R29  Resistance: 220R  [FP-CRCW0805-e3-MFG]  (hidden comment: CRCW0805220RFKEA)
R30  Resistance: 220R  [FP-CRCW0805-e3-MFG]  (hidden comment: CRCW0805220RFKEA)
R31  Resistance: 220R  [FP-CRCW0805-e3-MFG]  (hidden comment: CRCW0805220RFKEA)
R32  Resistance: 220R  [FP-CRCW0805-e3-MFG]  (hidden comment: CRCW0805220RFKEA)
R33  Resistance: 220R  [FP-CRCW0805-e3-MFG]  (hidden comment: CRCW0805220RFKEA)
R34  Resistance: 220R  [FP-CRCW0805-e3-MFG]  (hidden comment: CRCW0805220RFKEA)
R35  Resistance: 1K  [RESC2013X50X30NL20T20]  (hidden comment: CRCW08051K00FKEA)
R36  Resistance: 1K  [RESC2013X50X30NL20T20]  (hidden comment: CRCW08051K00FKEA)
R37  Resistance: 1K  [RESC2013X50X30NL20T20]  (hidden comment: CRCW08051K00FKEA)
R38  Resistance: 1K  [RESC2013X50X30NL20T20]  (hidden comment: CRCW08051K00FKEA)
R39  Resistance: 1K  [RESC2013X50X30NL20T20]  (hidden comment: CRCW08051K00FKEA)
R40  Resistance: 5.1K  [RESC2013X50X30NL20T20]  (hidden comment: 0805W8F5101T5E)
R41  Resistance: 5.1K  [RESC2013X50X30NL20T20]  (hidden comment: 0805W8F5101T5E)
SW4  K2-1102SP-C4SC-04  [TECO-FSM4JSMA_V]  (value not drawn)
SW5  K2-1102SP-C4SC-04  [TECO-FSM4JSMA_V]  (value not drawn)
SW6  K2-1102SP-C4SC-04  [TECO-FSM4JSMA_V]  (value not drawn)
SW7  K2-1102SP-C4SC-04  [TECO-FSM4JSMA_V]  (value not drawn)
SW8  K2-1102SP-C4SC-04  [TECO-FSM4JSMA_V]  (value not drawn)

### Nets
+5: P2.A4(VBUS) P2.A9(VBUS)
GND: P2.A1(GND) P2.A12(GND) R11.2 R12.2 R13.2 R14.2 R15.2 R16.2 R17.2 R18.2 R19.2 R20.2 R21.2 R22.2 R23.2 R24.2 R25.2 R26.2 R27.2 R28.2 R29.2 R30.2 R31.2 R32.2 R33.2 R34.2 R40.1 R41.1 SW4.4 SW5.4 SW6.4 SW7.4 SW8.4
A0: A0.1(A)
A1: A1.1(A)
A2: A2.1(A)
A3: A3.1(A)
A4: A4.1(A)
A5: A5.1(A)
A6: A6.1(A)
A7: A7.1(A)
A8: A8.1(A)
A9: A9.1(A)
A10: A10.1(A)
A11: A11.1(A)
A12: A12.1(A)
A13: A13.1(A)
A14: A14.1(A)
A15: A15.1(A)
D0: D0.1(A)
D1: D1.1(A)
D2: D2.1(A)
D3: D3.1(A)
D4: D4.1(A)
D5: D5.1(A)
D6: D6.1(A)
D7: D7.1(A)
PA0: R35.1
PA1: R36.1
PA2: R37.1
PA3: R38.1
PA4: R39.1
NetA0_2: A0.2(K) R11.1
NetA1_2: A1.2(K) R12.1
NetA2_2: A2.2(K) R13.1
NetA3_2: A3.2(K) R14.1
NetA4_2: A4.2(K) R15.1
NetA5_2: A5.2(K) R16.1
NetA6_2: A6.2(K) R17.1
NetA7_2: A7.2(K) R18.1
NetA8_2: A8.2(K) R19.1
NetA9_2: A9.2(K) R20.1
NetA10_2: A10.2(K) R21.1
NetA11_2: A11.2(K) R22.1
NetA12_2: A12.2(K) R23.1
NetA13_2: A13.2(K) R24.1
NetA14_2: A14.2(K) R25.1
NetA15_2: A15.2(K) R26.1
NetD0_2: D0.2(K) R27.1
NetD1_2: D1.2(K) R28.1
NetD2_2: D2.2(K) R29.1
NetD3_2: D3.2(K) R30.1
NetD4_2: D4.2(K) R31.1
NetD5_2: D5.2(K) R32.1
NetD6_2: D6.2(K) R33.1
NetD7_2: D7.2(K) R34.1
NetP2_A5: P2.A5(CC1) R40.2
NetP2_B5: P2.B5(CC2) R41.2
NetR35_2: R35.2 SW4.1
NetR36_2: R36.2 SW5.1
NetR37_2: R37.2 SW6.1
NetR38_2: R38.2 SW7.1
NetR39_2: R39.2 SW8.1

Not connected (* = marked no-connect by the designer): P2 A6(DP1)* A7(DN1)* A8(SBU1)* B8(SBU2)*; SW4 2* 3*; SW5 2* 3*; SW6 2* 3*; SW7 2* 3*; SW8 2* 3*

### Notes on the sheet
- (near A0) ADDRESS LEDs
- DATA LEDs
- POWER
- ADDRESS BUTTONS
- LEDs AND BUTTONs
- 3
- 5
- B
- MING JIE

### Library data of the parts
A0-A15 = CMP-2100-03577-1: Chip LED, Blue, 5 V, 25 mA, -40 to 85 degC, 2-Pin SMD (0603), RoHS, Tape and Reel; Manufacturer: Everlight Electronics; Test Current: 20mA; Number of LEDs: 1; Luminous Intensity: 28.5mcd; Lens Style: Rectangular; Forward Current: 25mA; Power Dissipation: 110W; Forward Voltage: 3V; Viewing Angle: 120degrees; Dominant Wavelength: 470nm; Max Operating Temperature: 85degC; Mount: SurfaceMount; Package Description: 2-Pin Surface Mount Device, Body 1.6 x 0.8 mm; Depth: 0.8mm; Packaging: TapeandReel; Length: 1.6mm; Radiation Hardening: No; Colour: Blue; Datasheet Version: Rev. 1.0, 03/2003; Min Operating Temperature: -40degC; Number of Elements: 1; Manufacturer URL: http://www.everlight.com/; Datasheet URL: https://datasheet.ciiva.com/26901/getdatasheetpartid-420616-26901324.pdf; Case/Package: SMD/SMT; Lead Free: LeadFree; RoHSCompliant: true; Number of Pins: 2
  A1-A15: Package Reference: 0603
D0-D7 = CMP-2100-03580-1: Green 520~535nm 0603 Light Emitting Diodes (LED) RoHS; Manufacturer: Everlight Electronics; Lens Style: Rectangular; Forward Voltage: 2V; Number of LEDs: 1; Viewing Angle: 120degrees; Colour: Green; RoHSCompliant: true; Datasheet URL: https://datasheet.ciiva.com/48679/19-217-g7c-an1p2-3t-48679179.pdf; Manufacturer URL: http://www.everlight.com/; Package Description: 2-Pin Surface Mount Device, Body 1.6 x 0.8 mm; Datasheet Version: Rev. 1, 04/2006; Mount: SurfaceMount; Lead Free: LeadFree; Number of Pins: 2
  D1-D7: Package Reference: 0603
P2 = USB-310D-B-SU: USB Type C Receptacle
R11-R34 = CMP-2001-03682-2: as R10 on sheet clock_module; Packaging: Tape and Reel; Termination: SMD/SMT; Height: 0.45mm; Package Quantity: 10; Width: 0.049inch; Min Operating Temperature: -55°C; Lead Free: Lead Free; Military Standard: Not; Mount: Surface Mount; Max Operating Temperature: 155°C; Voltage Rating (DC): 150V; Composition: Thick Film; Case/Package: 0805; Length: 2mm; Weight: 0.000194oz; Case Code (Metric): 2012; Number of Terminations: 2; Case Code (Imperial): 0805; Radiation Hardening: No; Tolerance: 1%; Features: Automotive AEC-Q200; Power Rating: 125mW; Depth: 1.25mm; Contact Plating: Tin; Temperature Coefficient: 100ppm/°C
R35-R39 = CMP-1013-00510-2: Manufacturer: Vishay Dale; Part Number: CRCW08051K00FKEA
R40 R41 = CMP-1013-00510-2: 5.1kΩ ±1% 0.125W ±100ppm/℃ 0805 Chip Resistor - Surface Mount RoHS; Manufacturer: UniOhm; Part Number: 0805W8F5101T5E
SW4-SW8 = CMP-2000-05602-2: as SW1 on sheet 65c02; Orientation: Straight; Datasheet URL: http://www.te.com/commerce/DocumentDelivery/DDEController?Action=showdoc&DocId=Customer+Drawing%7F2-1437565-7%7FV%7Fpdf%7FEnglish%7FENG_CD_2-1437565-7_V.pdf%7F4-1437565-2; Min Operating Temperature: -35degC; Packaging: LoosePiece; Termination: GullWing; Throw Configuration: SPST; Package Description: 4-Pin Surface Mount Device, Body 6 x 6 mm, Pitch 4.5 mm; Mounting Technology: SurfaceMount; Contact Plating: Silver; Datasheet Version: Rev. V, 02/2015; RoHSCompliant: true; Max Operating Temperature: 85degC; Length: 6mm; Voltage Rating (DC): 24V; Electrical Life: 100000Cycles; Current Rating: 50mA; Package Quantity: 750; Mount: SurfaceMount; Package Reference: FSM4JSMA; Manufacturer URL: http://www.te.com/; Width: 6mm; REACH SVHC: Unknown; Contact Material: CopperAlloy

## Sheet config_headers.SchDoc
size A4; SheetNumber: 4; SheetTotal: 5
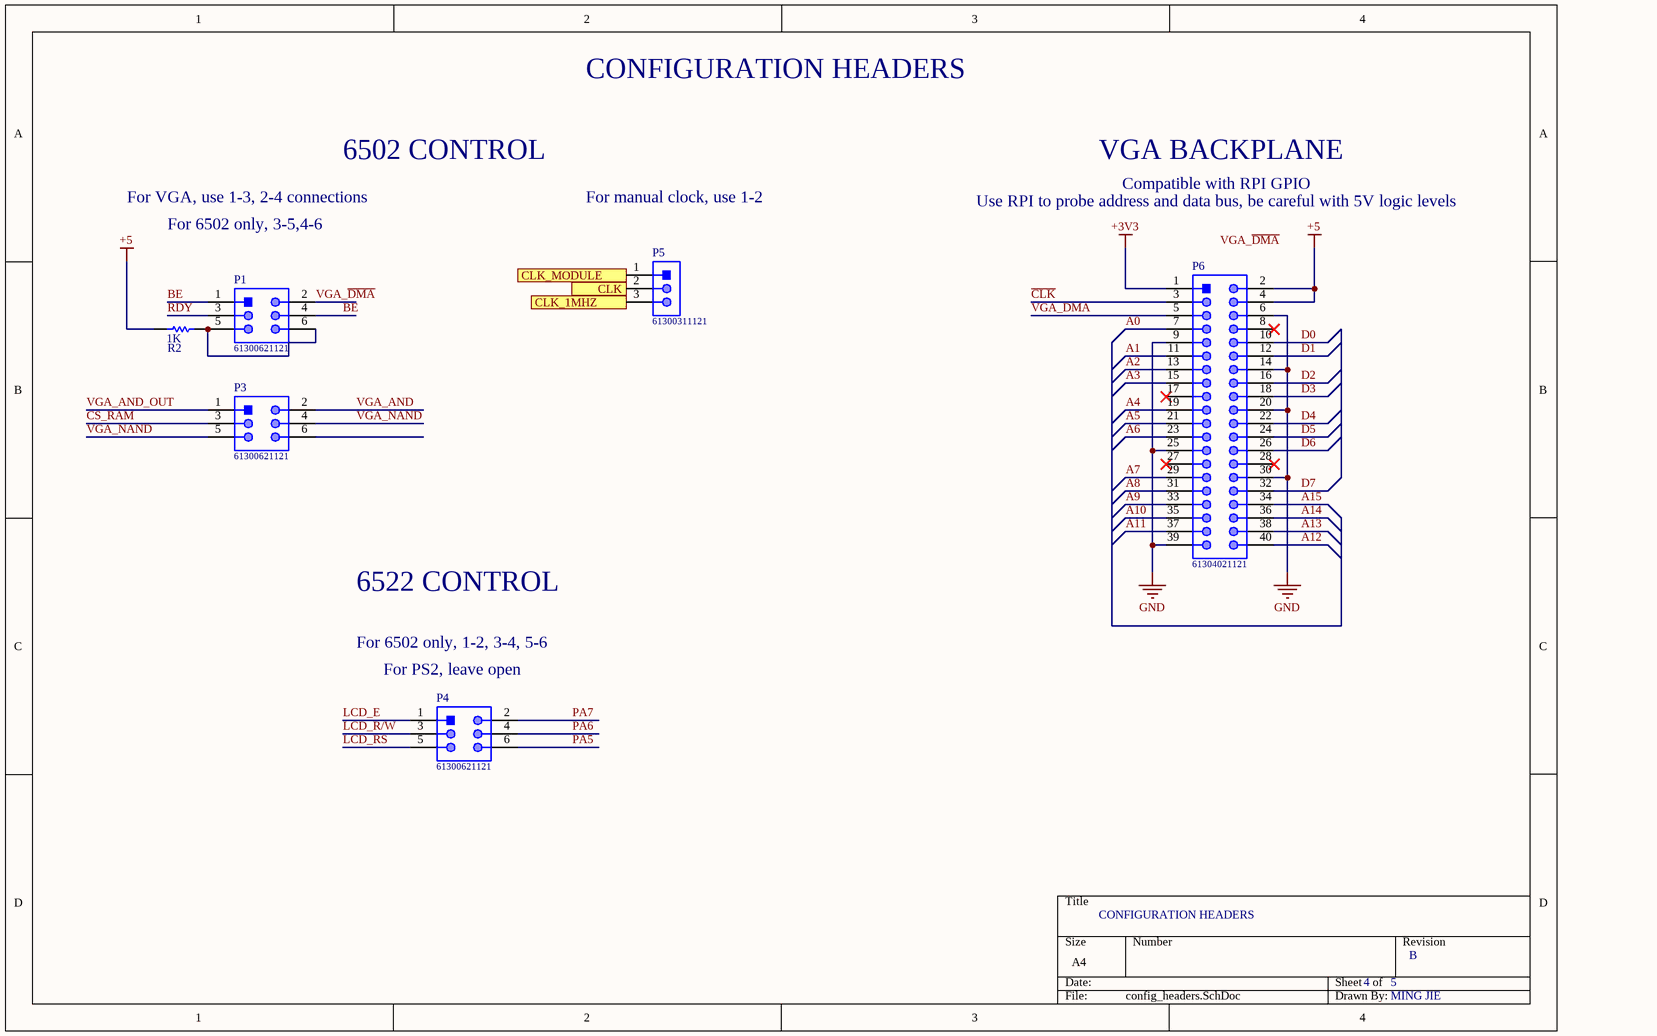
[diagram p3: config_headers.SchDoc]

### Parts
P1  61300621121  [61300621121]
P3  61300621121  [61300621121]
P4  61300621121  [61300621121]
P5  61300311121  [61300311121]
P6  61304021121  [61304021121]
R2  Resistance: 1K  [RESC2013X50X30NL20T20]  (hidden comment: CRCW08051K00FKEA)

### Ports
CLK (in), CLK_1MHZ (out), CLK_MODULE (out)

### Nets
+3V3: P6.1
+5: P6.2 P6.4 R2.1
GND: P6.6 P6.9 P6.14 P6.20 P6.25 P6.30 P6.39
A0: P6.7
A1: P6.11
A2: P6.13
A3: P6.15
A4: P6.19
A5: P6.21
A6: P6.23
A7: P6.29
A8: P6.31
A9: P6.33
A10: P6.35
A11: P6.37
A12: P6.40
A13: P6.38
A14: P6.36
A15: P6.34
BE: P1.1 P1.4
~{CLK}: P6.3
~{CS}_RAM: P3.3
CLK: P5.2 ; port CLK
D0: P6.10
D1: P6.12
D2: P6.16
D3: P6.18
D4: P6.22
D5: P6.24
D6: P6.26
D7: P6.32
LCD_E: P4.1
LCD_R/~{W}: P4.3
LCD_RS: P4.5
PA5: P4.6
PA6: P4.4
PA7: P4.2
RDY: P1.3
VGA_AND: P3.2
VGA_AND_OUT: P3.1
VGA_~{DMA}: P1.2 P6.5
VGA_NAND: P3.4 P3.5
NetCLK_1: P5.1 ; port CLK_MODULE
NetP1_5: P1.5 P1.6 R2.2
NetP5_3: P5.3 ; port CLK_1MHZ

Not connected (* = marked no-connect by the designer): P3 6; P6 8* 17* 27* 28*

### Notes on the sheet
- CONFIGURATION HEADERS
- 6502 CONTROL
- VGA BACKPLANE
- For VGA, use 1-3, 2-4 connections
- For 6502 only, 3-5,4-6
- For manual clock, use 1-2
- Use RPI to probe address and data bus, be careful with 5V logic levels
- Compatible with RPI GPIO
- 6522 CONTROL
- For 6502 only, 1-2, 3-4, 5-6
- (near P4) For PS2, leave open
- 4
- 5
- B
- MING JIE
- Labels drawn without touching a wire or pin: VGA_~{DMA}

### Library data of the parts
P1 P3 P4 = CMP-1502-01072-1: THT Vertical Pin Header WR-PHD, Pitch 2.54 mm, Dual Row, 6 pins; Manufacturer: Wurth Elektronik; Contact Resistance: 20mOhm; Withstanding Voltage: 500VAC; Pin Number: 6; Gender: Male; Pitch: 2.54mm; Working Voltage: 250VAC; Rated Current: 3A; Packaging: Bag; Row Number: Dual; Manufacturer URL: http://www.we-online.de; Part Number: 61300621121; Operating Temperature: -40to105degC; Mounting Technology: THT; Package Reference: 61300621121; Datasheet URL: https://katalog.we-online.de/em/datasheet/6130xx21121.pdf; Orientation: Vertical; Publisher: WurthElektronik
P5 = CMP-1502-01062-1: THT Vertical Pin Header WR-PHD, Pitch 2.54 mm, Single Row, 3 pins; Manufacturer: Wurth Elektronik; Withstanding Voltage: 500VAC; Working Voltage: 250VAC; Rated Current: 3A; Pitch: 2.54mm; Pin Number: 3; Gender: Male; Contact Resistance: 20mOhm; Package Reference: 61300311121; Manufacturer URL: http://www.we-online.de; Datasheet URL: https://katalog.we-online.de/em/datasheet/6130xx11121.pdf; Operating Temperature: -40to105degC; Part Number: 61300311121; Orientation: Vertical; Packaging: Bag; Row Number: Single; Mounting Technology: THT; Publisher: WurthElektronik
P6 = CMP-1502-01135-1: THT Vertical Pin Header WR-PHD, Pitch 2.54 mm, Dual Row, 40 pins; Manufacturer: Wurth Elektronik; Contact Resistance: 20mOhm; Pitch: 2.54mm; Pin Number: 40; Withstanding Voltage: 500VAC; Gender: Male; Rated Current: 3A; Working Voltage: 250VAC; Operating Temperature: -40to105degC; Manufacturer URL: http://www.we-online.de; Orientation: Vertical; Datasheet URL: https://katalog.we-online.de/em/datasheet/6130xx21121.pdf; Package Reference: 61304021121; Row Number: Dual; Part Number: 61304021121; Packaging: Bag; Mounting Technology: THT; Publisher: WurthElektronik
R2 = CMP-1013-00510-2: Manufacturer: Vishay Dale; Part Number: CRCW08051K00FKEA

## Sheet ps2_interface.SchDoc
size A4; SheetNumber: 5; SheetTotal: 5
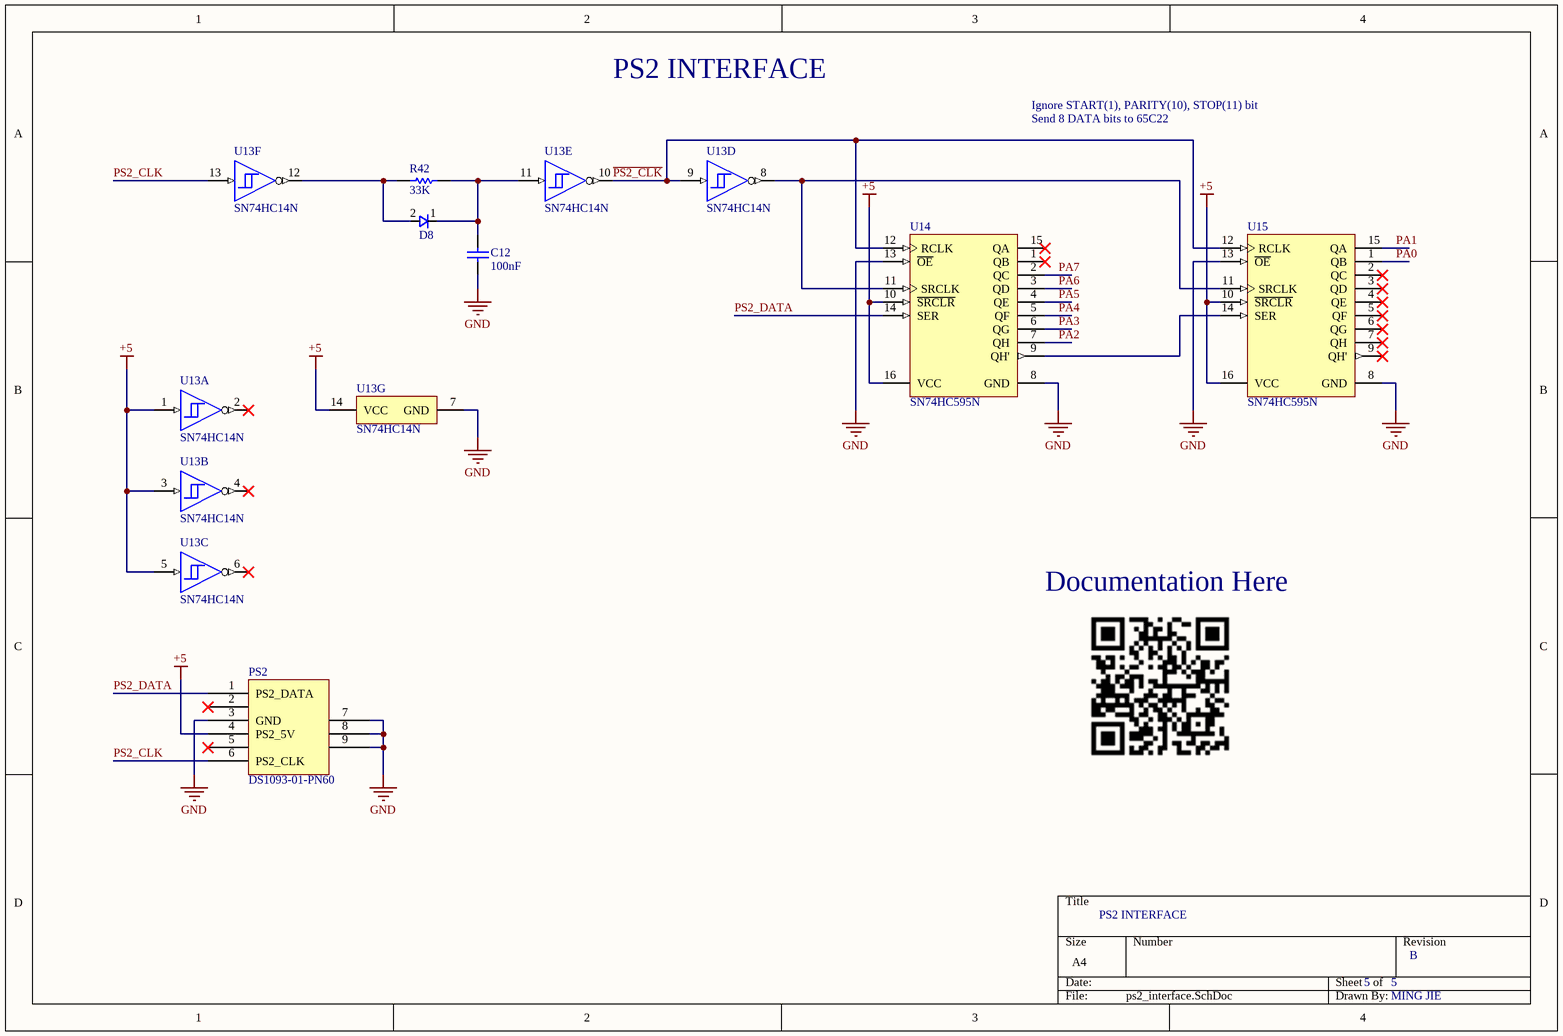
[diagram p4: ps2_interface.SchDoc]

### Parts
C12  Capacitance: 100nF  [CAPC2013X135X45ML10T25]  (hidden comment: GRM21BR71H104KA01L)
D8  Diode, General Purpose  [DO-214AC/SMA]  (value not drawn)
PS2  DS1093-01-PN60  [PS2_PORT]
R42  Resistance: 33K  [RESC2013X50X30NL20T20]  (hidden comment: 0805W8F3302T5E)
U13  SN74HC14N  [N0014A]  (parts A,B,C,D,E,F,G of 7)
U14  SN74HC595N  [N0016A]
U15  SN74HC595N  [N0016A]

### Nets
+5: PS2.4(PS2_5V) U13.1(1A) U13.3(2A) U13.5(3A) U13.14(VCC) U14.10(~{SRCLR}) U14.16(VCC) U15.10(~{SRCLR}) U15.16(VCC)
GND: C12.2 PS2.3(GND) PS2.7 PS2.8 PS2.9 U13.7(GND) U14.8(GND) U14.13(~{OE}) U15.8(GND) U15.13(~{OE})
~{PS2_CLK}: U13.9(4A) U13.10(~{5Y}) U14.12(RCLK) U15.12(RCLK)
PA0: U15.1(QB)
PA1: U15.15(QA)
PA2: U14.7(QH)
PA3: U14.6(QG)
PA4: U14.5(QF)
PA5: U14.4(QE)
PA6: U14.3(QD)
PA7: U14.2(QC)
PS2_CLK: PS2.6(PS2_CLK) U13.13(6A)
PS2_DATA: PS2.1(PS2_DATA) U14.14(SER)
NetC12_1: C12.1 D8.1 R42.2 U13.11(5A)
NetD8_2: D8.2 R42.1 U13.12(~{6Y})
NetU13_8: U13.8(~{4Y}) U14.11(SRCLK) U15.11(SRCLK)
NetU14_9: U14.9(QH') U15.14(SER)

Not connected (* = marked no-connect by the designer): PS2 2* 5*; U13 2(~{1Y})* 4(~{2Y})* 6(~{3Y})*; U14 1(QB)* 15(QA)*; U15 2(QC)* 3(QD)* 4(QE)* 5(QF)* 6(QG)* 7(QH)* 9(QH')*

### Notes on the sheet
- PS2 INTERFACE
- Ignore START(1), PARITY(10), STOP(11) bit
- Send 8 DATA bits to 65C22
- Documentation Here
- 5
- B
- MING JIE

### Library data of the parts
C12 = CMP-2100-03644-1: as C1 on sheet 65c02; Package Description: 2-Pin Surface Mount Device, Body 2 x 1.25 mm; Manufacturer URL: http://www.murata.com/; Case Code (Imperial): 0805; Datasheet URL: http://psearch.en.murata.com/capacitor/product/GRM21BR71H104KA01%23.pdf; Termination: SMD/SMT; Lead Free: LeadFree; Package Quantity: 1; Mount: SurfaceMount; REACH SVHC: Unknown; Thickness: 0.053inch; Height: 1.25mm; Case/Package: 0805; Voltage Rating: 50V; Width: 0.049inch; Case Code (Metric): 2012; Material: Ceramic; Min Operating Temperature: -55degC; RoHSCompliant: true; Datasheet Version: 42675.0; Voltage Rating (DC): 50V; Tolerance: 10%; Package Reference: 0805; Depth: 1.25mm; Length: 2mm; Max Operating Temperature: 125degC; Packaging: TapeandReel; Number of Pins: 2; Radiation Hardening: No
D8 = C95872: General Purpose Diode, SMT, DO-214
PS2 = PS2_CONN: PS2 Port
R42 = CMP-1013-00510-2: 33K, 0805 Chip Resistor, UniOhm; Part Number: 0805W8F3302T5E; Manufacturer: Uni Ohm
U13 = CMP-1615-00889-3: Hex Schmitt-Trigger Inverters, N0014A, TUBE; Manufacturer: Texas Instruments; Input Type: CMOS; Voltage(Nom)(V): 5; VCC(Min)(V): 2; tpd @ Nom Voltage(Max)(ns): 31; Technology Family: HC; VCC(Max)(V): 6; F @ Nom Voltage(Max)(Mhz): 20; Output Drive (IOL/IOH)(Max)(mA): -4/4; Rating: Catalog; Schmitt Trigger: Yes; ICC @ Nom Voltage(Max)(mA): 0.02; PackageReference: N0014A; Code_JEDEC: MS-001; Operating Temperature Range(C): -40 to 85; Generic Part Number: SN74HC14; Bits(#): 6; DatasheetVersion: SCLS085G; Output Type: CMOS
U14 U15 = CMP-0780-00137-3: 8-Bit Shift Registers With 3-State Output Registers, N0016A, TUBE; Manufacturer: Texas Instruments; F @ Nom Voltage(Max)(Mhz): 28; Input Type: CMOS; Bits: 8; VCC(Min)(V): 2; 3-State Output: Yes; ICC @ Nom Voltage(Max)(mA): 0.08; VCC(Max)(V): 6; tpd @ Nom Voltage(Max)(ns): 34; Rating: Military; Technology Family: HC; Output Drive (IOL/IOH)(Max)(mA): 7.8/-7.8; Code_JEDEC: MS-001; Output Type: CMOS; Operating Temperature Range(C): -40 to 85; Voltage(Nom)(V): 6; Generic Part Number: SN74HC595; DatasheetVersion: SCLS041H; PackageReference: N0016A; PackageVersion: http://www.ti.com/lit/ml/mpdi002c/mpdi002c.pdf

## Nets that join several sheets
+5: 65c02 (15 pins), clock_module (15 pins), address_LEDs (P2.A4 P2.A9), config_headers (P6.2 P6.4 R2.1), ps2_interface (9 pins)
GND: 65c02 (16 pins), clock_module (17 pins), address_LEDs (33 pins), config_headers (7 pins), ps2_interface (10 pins)
A0: 65c02 (U1.38 U2.10 U3.10 U4.9), address_LEDs (A0.1), config_headers (P6.7)
A1: 65c02 (U1.37 U2.9 U3.9 U4.10), address_LEDs (A1.1), config_headers (P6.11)
A2: 65c02 (U1.36 U2.8 U3.8 U4.11), address_LEDs (A2.1), config_headers (P6.13)
A3: 65c02 (U1.35 U2.7 U3.7 U4.12), address_LEDs (A3.1), config_headers (P6.15)
A4: 65c02 (U2.6 U3.6 U4.13), address_LEDs (A4.1), config_headers (P6.19)
A5: 65c02 (U2.5 U3.5 U4.14), address_LEDs (A5.1), config_headers (P6.21)
A6: 65c02 (U2.4 U3.4 U4.15), address_LEDs (A6.1), config_headers (P6.23)
A7: 65c02 (U2.3 U3.3 U4.16), address_LEDs (A7.1), config_headers (P6.29)
A8: 65c02 (U2.25 U3.25 U4.17), address_LEDs (A8.1), config_headers (P6.31)
A9: 65c02 (U2.24 U3.24 U4.18), address_LEDs (A9.1), config_headers (P6.33)
A10: 65c02 (U2.21 U3.21 U4.19), address_LEDs (A10.1), config_headers (P6.35)
A11: 65c02 (U2.23 U3.23 U4.20), address_LEDs (A11.1), config_headers (P6.37)
A12: 65c02 (U2.2 U3.2 U4.22), address_LEDs (A12.1), config_headers (P6.40)
A13: 65c02 (U1.24 U2.26 U3.26 U4.23), address_LEDs (A13.1), config_headers (P6.38)
A14: 65c02 (U2.1 U3.1 U4.24 U6.4), address_LEDs (A14.1), config_headers (P6.36)
A15: 65c02 (U4.25 U6.12 U6.13), address_LEDs (A15.1), config_headers (P6.34)
BE: 65c02 (U4.36), config_headers (P1.1 P1.4)
~{CLK}: 65c02 (U6.3), config_headers (P6.3)
~{CS}_RAM: 65c02 (U3.20), config_headers (P3.3)
CLK: 65c02 (5 pins), config_headers (P5.2)
D0: 65c02 (U1.33 U2.11 U3.11 U4.33), address_LEDs (D0.1), config_headers (P6.10)
D1: 65c02 (U1.32 U2.12 U3.12 U4.32), address_LEDs (D1.1), config_headers (P6.12)
D2: 65c02 (U1.31 U2.13 U3.13 U4.31), address_LEDs (D2.1), config_headers (P6.16)
D3: 65c02 (U1.30 U2.15 U3.15 U4.30), address_LEDs (D3.1), config_headers (P6.18)
D4: 65c02 (U1.29 U2.16 U3.16 U4.29), address_LEDs (D4.1), config_headers (P6.22)
D5: 65c02 (U1.28 U2.17 U3.17 U4.28), address_LEDs (D5.1), config_headers (P6.24)
D6: 65c02 (U1.27 U2.18 U3.18 U4.27), address_LEDs (D6.1), config_headers (P6.26)
D7: 65c02 (U1.26 U2.19 U3.19 U4.26), address_LEDs (D7.1), config_headers (P6.32)
LCD_E: 65c02 (U5.6), config_headers (P4.1)
LCD_R/~{W}: 65c02 (U5.5), config_headers (P4.3)
LCD_RS: 65c02 (U5.4), config_headers (P4.5)
NetCLK_1: clock_module (CLK.1 U10.8 U11.5), config_headers (P5.1)
NetP5_3: 65c02 (X1.3), config_headers (P5.3)
~{PS2_CLK}: 65c02 (U1.40), ps2_interface (U13.9 U13.10 U14.12 U15.12)
PA0: 65c02 (U1.2), address_LEDs (R35.1), ps2_interface (U15.1)
PA1: 65c02 (U1.3), address_LEDs (R36.1), ps2_interface (U15.15)
PA2: 65c02 (U1.4), address_LEDs (R37.1), ps2_interface (U14.7)
PA3: 65c02 (U1.5), address_LEDs (R38.1), ps2_interface (U14.6)
PA4: 65c02 (U1.6), address_LEDs (R39.1), ps2_interface (U14.5)
PA5: 65c02 (U1.7), config_headers (P4.6), ps2_interface (U14.4)
PA6: 65c02 (U1.8), config_headers (P4.4), ps2_interface (U14.3)
PA7: 65c02 (U1.9), config_headers (P4.2), ps2_interface (U14.2)
RDY: 65c02 (U4.2), config_headers (P1.3)
VGA_AND: 65c02 (U10.12), config_headers (P3.2)
VGA_AND_OUT: 65c02 (U10.11), config_headers (P3.1)
VGA_~{DMA}: 65c02 (U10.13), config_headers (P1.2 P6.5)
VGA_NAND: 65c02 (U6.8), config_headers (P3.4 P3.5)